# EAGLE design offworld1 (EAGLE 7.6.0)
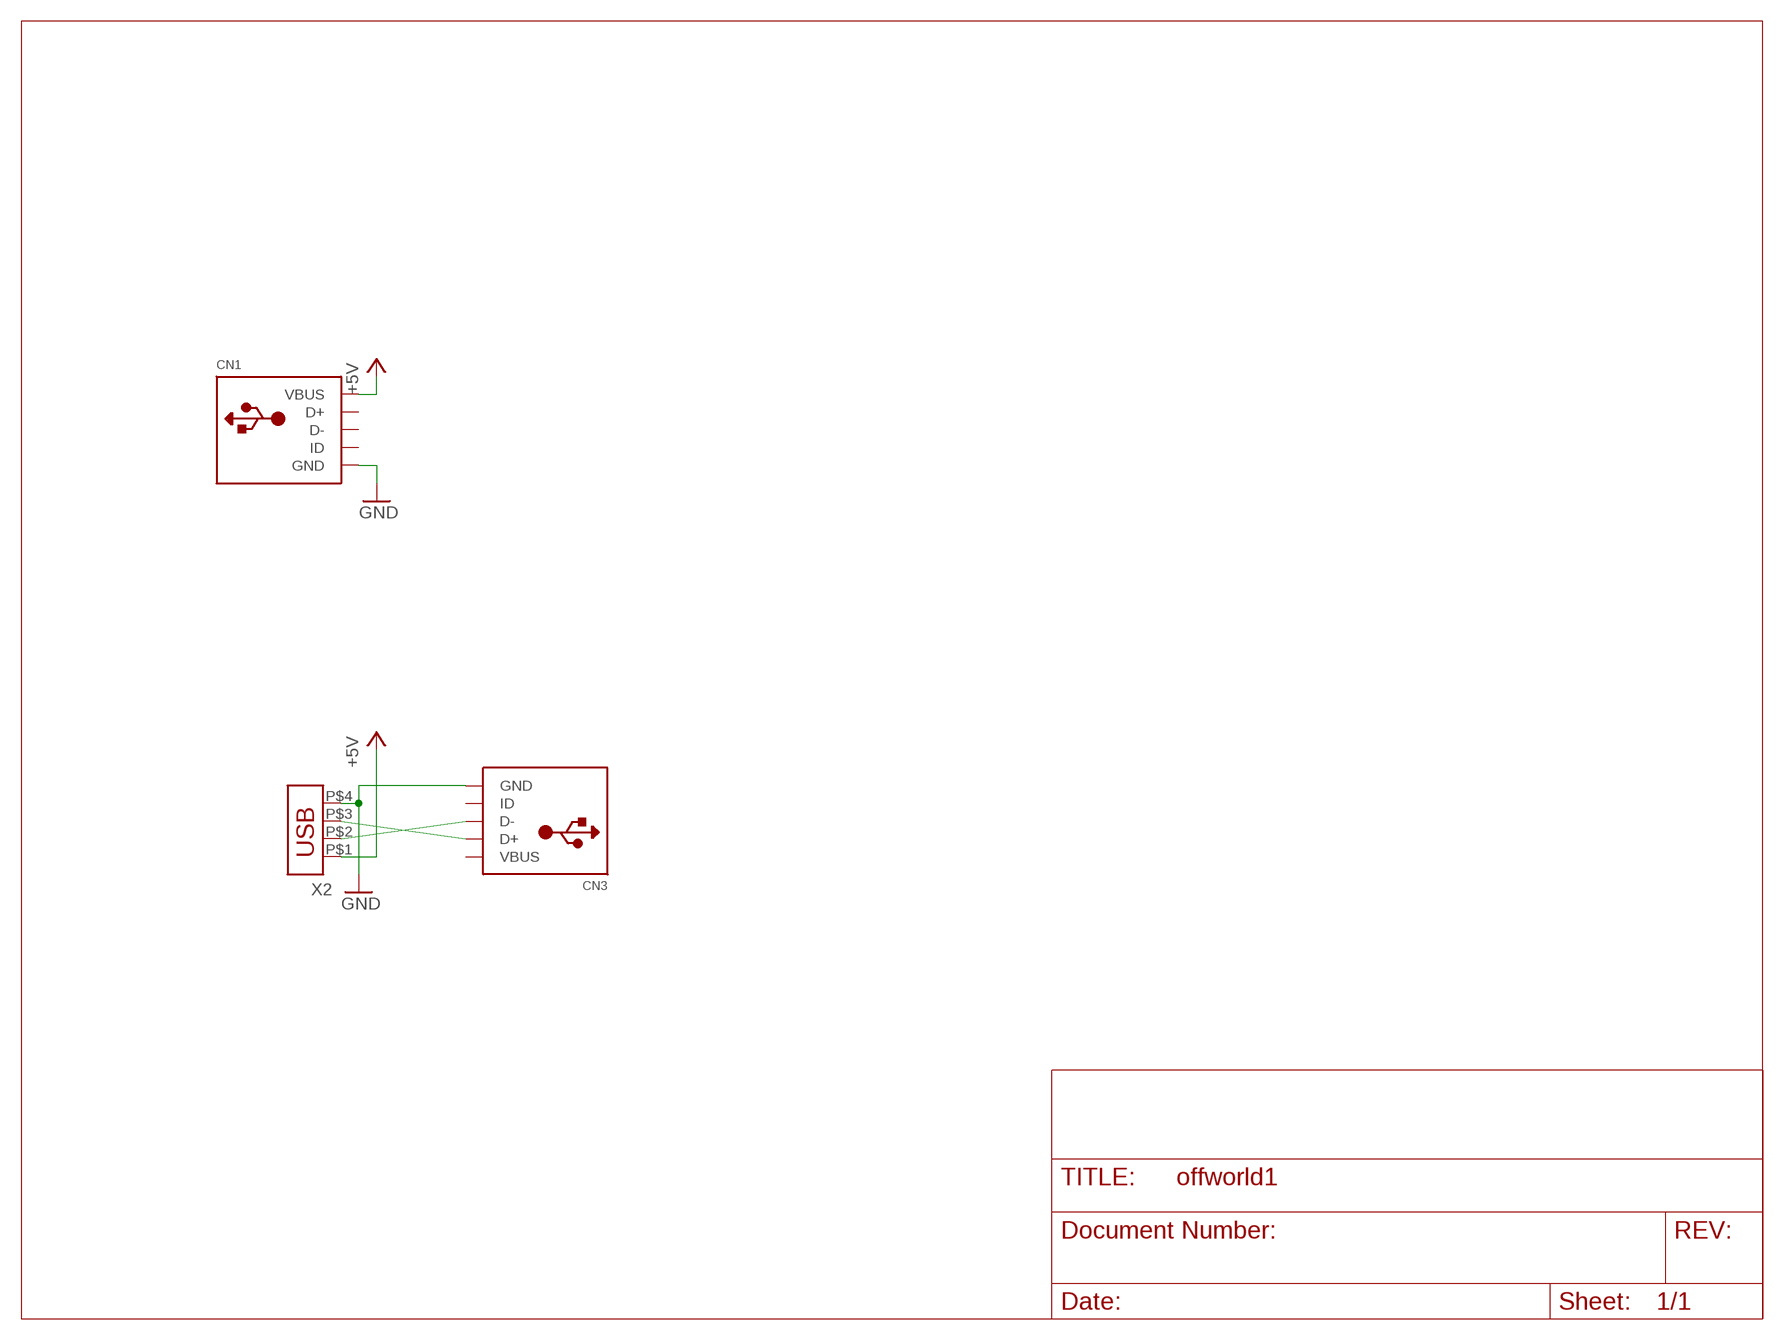
[diagram p0: schematic, sheet 1]

## Parts
CN1  USBMOLEX  [USB-MINIB-THM-MOLEX]
CN3  USBMOLEX  [USB-MINIB-THM-MOLEX]
X2  USB-787616MID  [USBA-MID]

## Nets
+5V: CN1.VBUS X2.P$1
GND: CN1.GND CN3.GND X2.P$4
N$3: CN3.D+ X2.P$3
N$4: CN3.D- X2.P$2
Unconnected: CN1.D+ CN1.D- CN1.ID CN3.ID

## Power pins joined to a net without a drawn wire
VBUS: CN3.VBUS

## Library data of the parts
CN1 CN3 = adafruit:USB: USB Connectors USBMINIB - Surface Mount Female Mini-B USB Connector 4UConnector: 06564 By microbuilder.eu Thru-hole RA Female Mini-B USB Connector 4UConnector: 18732 By ladyada.net
X2 = lines:USB-787616: AMP connector

## Board
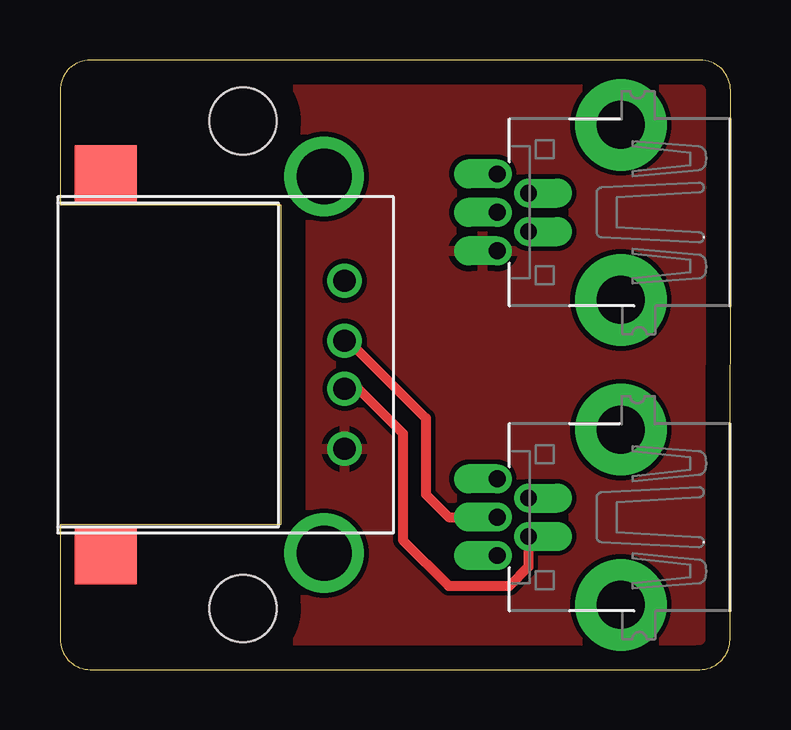
[diagram p1: board, top side]
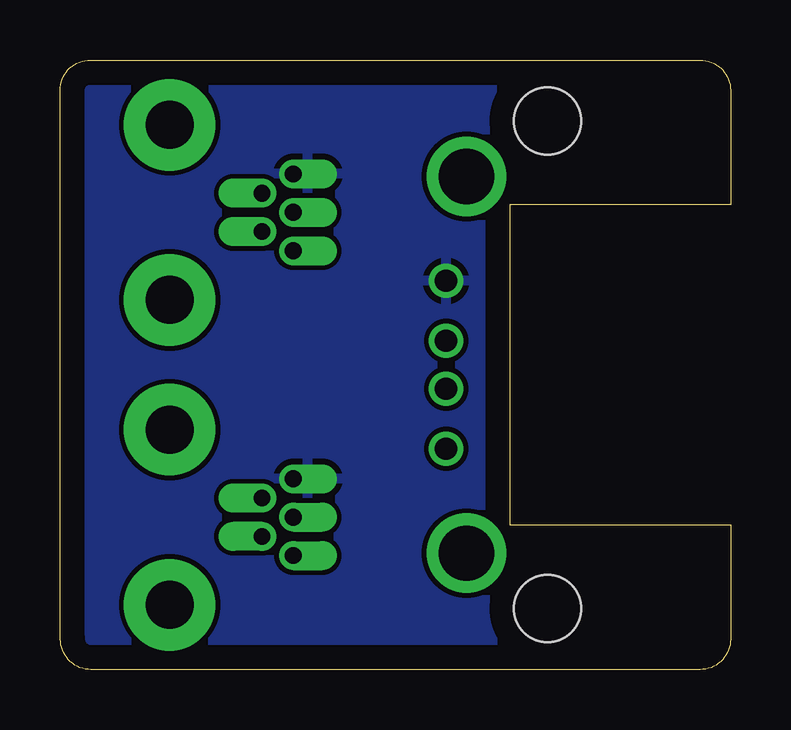
[diagram p2: board, bottom side, seen from below]

Size 27.94 x 25.4 mm. Coordinates in mm from the lower left corner, seen from the top.
Outline: 0,24.13 0,19.37 9.21,19.37 9.21,6.03 0,6.03 0,1.27 arc90 1.27,0 26.65,0 arc90 27.92,1.27 27.94,24.13 arc90 26.67,25.4 1.27,25.4 arc90 0,24.13
Copper layers (1*16): Top 0.035mm / dielectric 1.5mm / Bottom 0.035mm
Design rules "default": minimum track width 10mil, minimum drill 24mil, track to track 8mil, track to pad 8mil, pad to pad 8mil, via to via 8mil, smd to smd 8mil, copper to edge 40mil, drill to drill 8mil, minimum pad ring 10mil, minimum via ring 8mil, stop-mask expansion 4mil, vias tented up to drill 0mil, thermal gap 10mil
Holes 2.8 mm at 7.62,22.86 7.62,2.54

### Footprints (pad centres in the part's own frame; a part is rotated, then mirrored left to right if it is on the bottom)
USB-MINIB-THM-MOLEX = drill 0.7 offset: D+ 0,9.72; D- -0.8,8.42; GND 1.6,9.72; ID 0.8,8.42; VBUS -1.6,9.72 | drill 2 pad 3.81: GND1 -3.65,4.57; GND4 3.65,4.57
USBA-MID = drill 0.92: P$1 3.5,9.95; P$2 1,9.95; P$3 -1,9.95; P$4 -3.5,9.95 | drill 2.3: P$5 7.85,9.1; P$6 -7.85,9.1 | smd 2.4 x 2.6: P$7 7.95,0; P$8 -7.95,0

### Placement (x,y rotation side)
CN1  27.94,19.05 90 top
CN3  27.94,6.35 90 top
X2  1.91,12.7 270 top

### Tracks (layer width: path | path; a pad name or v marks a point on that pad's centre or on a via)
+5V
  pour Top: 0,25.4 0,0 27.94,0 27.94,24.13 arc90 26.67,25.4
GND
  pour Bottom: 0,25.4 0,0 27.94,0 27.94,25.4
N$3
  Top 0.406: X2.P$3 12.02,13.7 15.24,10.48 15.24,7.3 16.19,6.35 CN3.D+
N$4
  Top 0.406: X2.P$2 12.43,11.7 14.29,9.84 14.29,5.4 16.19,3.49 18.73,3.49 19.52,4.28 CN3.D-